# Altium schematic sheet power inputs.SchDoc
size A4
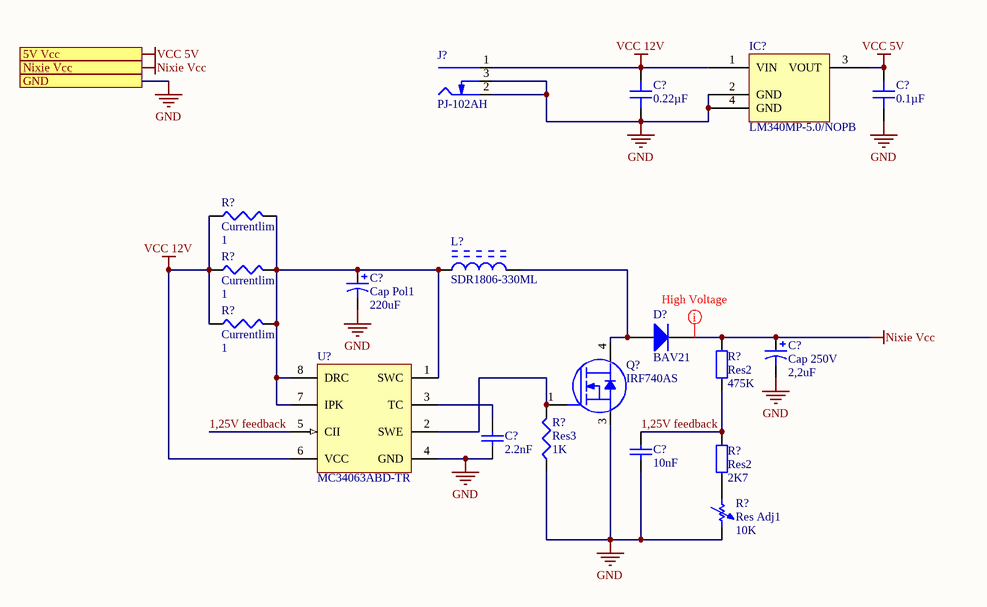
[diagram p0: power inputs.SchDoc]

## Parts
(Parts that share a designator on the sheet are numbered #1, #2 ... from top to bottom, then left to right.)
C?#1  0.22µF  [CAP 0805_2012]
C?#2  0.1µF  [CAP 0805_2012]
C?#3  Cap Pol1  value 220uF  [RB7.6-15]
C?#4  Cap 250V  value 2,2uF  [RB7.6-15]
C?#5  2.2nF  [CAPC0805(2012)145_M]
C?#6  10nF  [CAPC0805(2012)145_M]
D?  BAV21  [DO-41]
IC?  LM340MP-5.0/NOPB  [TI SOT-223 DCY]
J?  PJ-102AH  [CUI PJ-102AH]
L?  SDR1806-330ML  [BOUR-SDR1806_V]
Q?  IRF740AS  [TO-263AB]
R?#1  Currentlim  value 1  [J1-0603]
R?#2  Currentlim  value 1  [J1-0603]
R?#3  Currentlim  value 1  [J1-0603]
R?#4  Res2  value 475K  [AXIAL-0.4]
R?#5  Res3  value 1K  [J1-0603]
R?#6  Res2  value 2K7  [AXIAL-0.4]
R?#7  Res Adj1  value 10K  [AXIAL-0.7]
U?  MC34063ABD-TR  [SO8_N]

## Ports
5V Vcc (out), GND, Nixie Vcc (out)

## Nets
GND: C?#1.1 C?#2.1 C?#3.2 C?#4.2 C?#5.1 C?#6.1 IC?.2(GND) IC?.4(GND) J?.2(Outer) J?.3(SW) Q?.3(Drain) R?#5.1 R?#7.2 U?.4(GND) ; port GND
Nixie Vcc: C?#4.1 D?.2(K) R?#4.2 ; port Nixie Vcc
VCC 5V: C?#2.2 IC?.3(VOUT) ; port 5V Vcc
VCC 12V: C?#1.2 IC?.1(VIN) J?.1(Centre) R?#1.1 R?#2.1 R?#3.1 U?.6(VCC)
1,25V feedback: C?#6.2 R?#4.1 R?#6.2 U?.5(CII)
NetC?#3_1: C?#3.1 L?.1 R?#1.2 R?#2.2 R?#3.2 U?.1(SWC) U?.7(IPK) U?.8(DRC)
NetC?#5_2: C?#5.2 U?.3(TC)
NetD?_1: D?.1(A) L?.2 Q?.4(Source)
NetQ?_1: Q?.1(Gate) R?#5.2 U?.2(SWE)
NetR?#6_1: R?#6.1 R?#7.1

## Layout directives
mark named High Voltage: Nixie Vcc

## Library data of the parts
C?#1 = CC0805KRX7R8BB224: CAP CER 0.22UF 25V X7R 0805; Manufacturer: Yageo; Tolerance: ±10%; Part Number: CC0805KRX7R8BB224; Value: 0.22µF; Applications: General Purpose; Capacitance: 0.22µF; ComponentLink1Description: Datasheet; ComponentLink1URL: https://www.yageo.com/upload/media/product/productsearch/datasheet/mlcc/UPY-GPHC_X7R_6.3V-to-50V_18.pdf; ComponentLink2Description: DigiKey Link; ComponentLink2URL: http://digikey.com/product-detail/en/yageo/CC0805KRX7R8BB224/311-1432-1-ND/2833738; Device Package: 0805 (2012 Metric); Features: High Voltage; LastUpdated: 21.01.2020 00:03:06; Lifecycle Status: Active; Minimum Order: 1; Mounting Type: Surface Mount, MLCC; Operating Temperature: -55°C ~ 125°C; Package / Case: 0805 (2012 Metric); Packaging: TapeAndReel; PartId: 2517; Part Status: Active; Price: 0.02; Series: CC; Size / Dimension: 0.079" L x 0.049" W (2.00mm x 1.25mm); Supplier 1: DigiKey; Supplier Part Number 1: 311-1432-1-ND; Temperature Coefficient: X7R; Thickness (Max): 0.037" (0.95mm); Voltage - Rated: 25V
C?#2 = 0805ZD104KAT2A: CAP CER 0.1UF 10V X5R 0805; Manufacturer: AVX Corporation; Tolerance: ±10%; Part Number: 0805ZD104KAT2A; Value: 0.1µF; Applications: General Purpose; Capacitance: 0.1µF; ComponentLink1Description: Datasheet; ComponentLink1URL: http://datasheets.avx.com/cx5r.pdf; ComponentLink2Description: DigiKey Link; ComponentLink2URL: http://digikey.com/product-detail/en/avx-corporation/0805ZD104KAT2A/478-12799-1-ND/9949339; Device Package: 0805 (2012 Metric); LastUpdated: 21.01.2020 00:02:37; Lifecycle Status: Active; Minimum Order: 1; Mounting Type: Surface Mount, MLCC; Operating Temperature: -55°C ~ 85°C; Package / Case: 0805 (2012 Metric); Packaging: TapeAndReel; PartId: 18470; Part Status: Active; Price: 0.01; Series: -; Size / Dimension: 0.079" L x 0.049" W (2.01mm x 1.25mm); Supplier 1: DigiKey; Supplier Part Number 1: 478-12799-1-ND; Temperature Coefficient: X5R; Thickness (Max): 0.055" (1.40mm); Voltage - Rated: 10V
C?#3 C?#4 = Cap Pol1: Polarized Capacitor (Radial); Published: 8-Jun-2000; LatestRevisionDate: 17-Jul-2002; LatestRevisionNote: Re-released for DXP Platform.; PackageReference: RB7.6-15; Publisher: Altium Limited; PackageDescription: Polarized Capacitor (Radial); 2 Leads
C?#5 C?#6 = CMP-1036-03245-1: CAP 2.2nF 16V ±10% 0805 (2012 Metric) Thickness 1.45mm SMD; Case-EIA: 0805; Tolerance: Â±10%; Case-Metric: 2012; Rated Voltage: 16 V; Technology: SMT; Value: 2.2nF; Max Thickness: 1.45 mm
D? = Diode 1N4006: Published: 8-Jun-2000; LatestRevisionDate: 17-Jul-2002; LatestRevisionNote: Re-released for DXP Platform.; DatasheetVersion: 1998; PackageVersion: Aug-1999; PackageReference: DO-41; Publisher: Altium Limited; PackageDescription: Diode, Axial; Body 5.2 x 2.7 mm (LxDia. max), Lead Dia. 0.86 mm (max); Code_JEDEC: DO-204-AL; ComponentLink1Description: Manufacturer Link; ComponentLink1URL: http://www.fairchildsemi.com/; ComponentLink2Description: Datasheet; ComponentLink2URL: http://www.fairchildsemi.com/ds/1N%2F1N4001.pdf
IC? = LM340MP-5.0/NOPB: IC REG LINEAR 5V 1A SOT223-4; Manufacturer: Texas Instruments; Current - Output: 1.5A; Current - Quiescent (Iq): 8mA; Number of Regulators: 1; Output Configuration: Positive; Output Type: Fixed; Protection Features: Over Current, Short Circuit; PSRR: 70dB (120Hz); Voltage Dropout (Max): 2V @ 1A; Voltage - Input (Max): 35V; Part Number: LM340MP-5.0/NOPB; ComponentLink1Description: Datasheet; ComponentLink1URL: http://www.ti.com/general/docs/suppproductinfo.tsp?distId=10&gotoUrl=http%3A%2F%2Fwww.ti.com%2Flit%2Fgpn%2Flm340; ComponentLink2Description: DigiKey Link; ComponentLink2URL: //digikey.com/product-detail/en/texas-instruments/LM340MP-5.0-NOPB/LM340MP-5.0-NOPBTR-ND/270717; Device Package: TO-261-4, TO-261AA; LastUpdated: 09.12.2019 14:40:17; Lifecycle Status: 0; Minimum Order: 1; Mounting Type: Surface Mount; Operating Temperature: 0°C ~ 125°C; Package / Case: TO-261-4, TO-261AA; Packaging: TapeAndReel; Part Status: Active; Price: 0.56; Series: -; Supplier 1: DigiKey; Supplier Part Number 1: LM340MP-5.0/NOPBTR-ND; Supplier Device Package: SOT-223-4; Voltage - Output (Min/Fixed): 5V
J? = PJ-102AH: CONN PWR JACK 2X5.5MM SOLDER; Manufacturer: CUI Devices; Actual Diameter: 0.079" (2.00mm ID), 0.256" (6.50mm OD); Current Rating (Amps): 5A; Gender: Male; Industry Recognized Mating Diameter: 2.00mm ID (0.079"), 5.50mm OD (0.217"); Internal Switch(s): Single Switch, Normally Closed; Material Flammability Rating: UL94 V-0; Mating Length/Depth: 0.354" (9.00mm); Number of Positions/Contacts: 2 Conductors, 3 Contacts; Shielding: Unshielded; Voltage - Rated: 24VDC; Part Number: PJ-102AH; ComponentLink1Description: Datasheet; ComponentLink1URL: https://www.cuidevices.com/product/resource/digikeypdf/pj-102ah.pdf; ComponentLink2Description: DigiKey Link; ComponentLink2URL: //digikey.com/product-detail/en/cui-devices/PJ-102AH/CP-102AH-ND/408448; Connector Type: Jack; LastUpdated: 16.12.2019 19:01:27; Lifecycle Status: 0; Minimum Order: 1; Mounting Type: Through Hole, Right Angle; Packaging: Tray; Part Status: Active; Price: 0.76; Series: -; Supplier 1: DigiKey; Supplier Part Number 1: CP-102AH-ND; Termination: Solder
L? = CMP-2000-07043-1: Power Inductor, 33 uH, +/- 20%, -40 to 125 degC, 2-Pin SMD, RoHS, Tape and Reel; Manufacturer: Bourns; Minimum Quality Factor: 24@2.52MHz; Product Height: 6.9mm; Core Material: Ferrite; Maximum DC Current: 3A; Maximum DC Resistance: 68mOhm; Product Depth: 14.3mm; Inductance: 33uH; Rad Hard: No; Packaging: Tape&Reel; Mounting Technology: SurfaceMount; Manufacturer URL: http://www.bourns.com/; Package Description: 2-Pin Surface Mount Device, Body 18.3 x 14 mm; Type: Power; Package Reference: SDR1806; Datasheet URL: http://www.bourns.com/docs/Product-Datasheets/SDR1806.pdf; Tolerance: 20%; Datasheet Version: 09/2010; Package/Case: 18.6X14.3X6.9
Q? = 4548: NMos tranistor; id: 4548; pakke_opprettet_av: 2099; pris: 0; produsent: Vishay; pakketype: TO-263; pakke_opprettet: 11.10.2018 00:43:09; symbol_opprettet_av: 2099; symbol_opprettet: 11.10.2018 00:41:25; navn: IRF740AS
R?#1-R?#3 R?#5 = Res3: Resistor; Published: 8-Jun-2000; LatestRevisionDate: 29-May-2009; LatestRevisionNote: IPC-7351 Footprint Added.; PackageReference: J1-0603; Publisher: Altium Limited; PackageDescription: Chip Resistor
R?#4 R?#6 = Res2: Resistor; Published: 8-Jun-2000; LatestRevisionDate: 17-Jul-2002; LatestRevisionNote: Re-released for DXP Platform.; PackageReference: AXIAL-0.4; Publisher: Altium Limited; PackageDescription: Axial Device, Thru-Hole; 2 Leads; 0.4 in Pin Spacing
R?#7 = Res Adj1: Variable Resistor; Set Position: 0.5; Published: 8-Jun-2000; LatestRevisionDate: 17-Jul-2002; LatestRevisionNote: Re-released for DXP Platform.; PackageReference: AXIAL-0.7; Publisher: Altium Limited; PackageDescription: Axial Device, Thru-Hole; 2 Leads; 0.7 in Pin Spacing
U? = CMP-0241-00017-1: DC/DC converter control circuit, 8-Pin SO, Tape and Reel; PackageReference: SO8; DatasheetVersion: Nov-2007; PackageDescription: 8-Pin Small Outline Integrated Circuit 1.27 mm Pitch; ComponentLink3URL: http://www.st.com/internet/com/TECHNICAL_RESOURCES/TECHNICAL_LITERATURE/PACKAGE_INFORMATION/CD00004680.pdf; ComponentLink2Description: Datasheet; PackageVersion: Dec-2002; ComponentLink1URL: http://www.st.com; ComponentLink2URL: http://www.st.com/internet/com/TECHNICAL_RESOURCES/TECHNICAL_LITERATURE/DATASHEET/CD00001232.pdf; ComponentLink1Description: Manufacturer URL; ComponentLink3Description: Package Specification; Code_IPC: SOIC127P600-8; Code_JEDEC: MS-012-AA